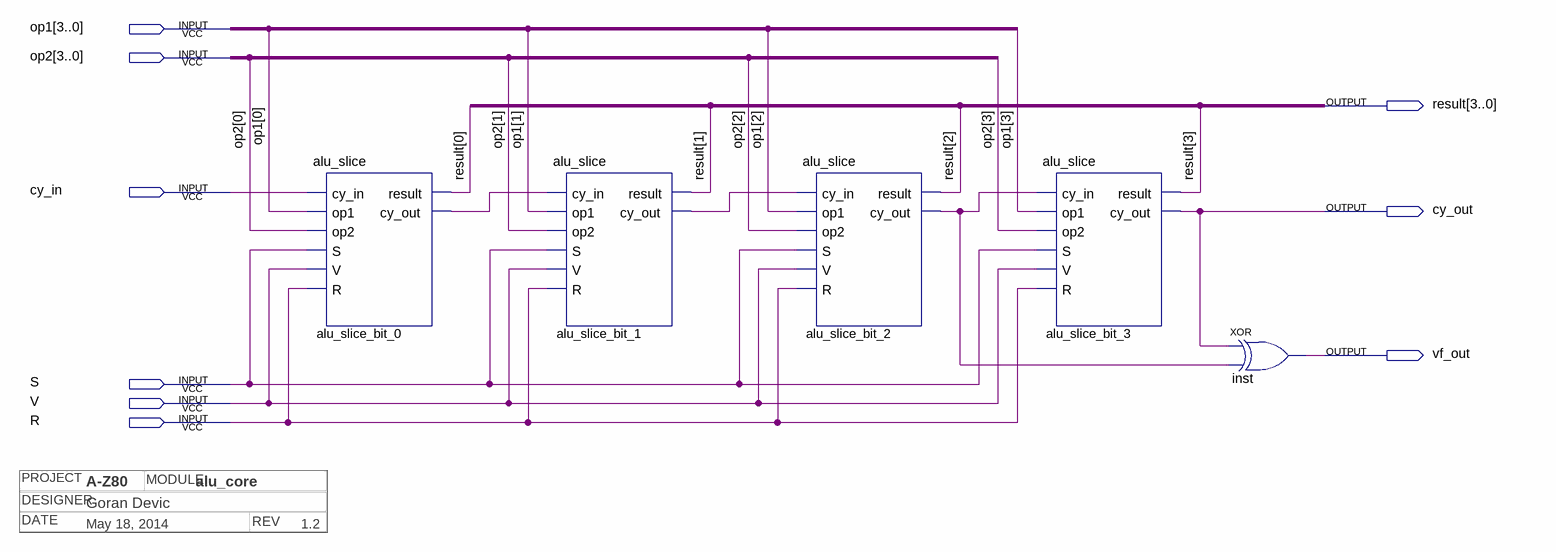
[diagram p0: schematic sheet]
// Quartus schematic alu_core.bdf as structural Verilog: 5 symbols, 9 pins
// Title block: PROJECT: A-Z80; MODULE: alu_core; DESIGNER: Goran Devic; DATE: May 18, 2014; REV: 1.2
module alu_core (
  input  [3:0] op1,
  input  [3:0] op2,
  input  cy_in,
  input  S,
  input  V,
  input  R,
  output [3:0] result,
  output cy_out,
  output vf_out
);

  wire alu_slice_bit_0_cy_out, alu_slice_bit_1_cy_out, alu_slice_bit_2_cy_out;

  alu_slice alu_slice_bit_0 (
    .cy_in(cy_in), .op1(op1[0]), .op2(op2[0]), .S(S), .V(V), .R(R), .result(result[0]),
    .cy_out(alu_slice_bit_0_cy_out));
  alu_slice alu_slice_bit_1 (
    .cy_in(alu_slice_bit_0_cy_out), .op1(op1[1]), .op2(op2[1]), .S(S), .V(V), .R(R), .result(result[1]),
    .cy_out(alu_slice_bit_1_cy_out));
  alu_slice alu_slice_bit_2 (
    .cy_in(alu_slice_bit_1_cy_out), .op1(op1[2]), .op2(op2[2]), .S(S), .V(V), .R(R), .result(result[2]),
    .cy_out(alu_slice_bit_2_cy_out));
  alu_slice alu_slice_bit_3 (
    .cy_in(alu_slice_bit_2_cy_out), .op1(op1[3]), .op2(op2[3]), .S(S), .V(V), .R(R), .result(result[3]),
    .cy_out(cy_out));
  xor inst (vf_out, cy_out, alu_slice_bit_2_cy_out);
endmodule
